# Altium schematic sheet LVR_3V3_PS.SchDoc: 3V3 Linear Voltage Regulator
size B; Date: 2015-01-30; Author: Marcin Czajkowski; Organization: Marcin Czajkowski; Address1: SN:3547684; Address2: ESE-Year2; Address3: Conestoga College; Address4: Project IV; DocumentNumber: 1; Revision: A; SheetNumber: 10; SheetTotal: 14
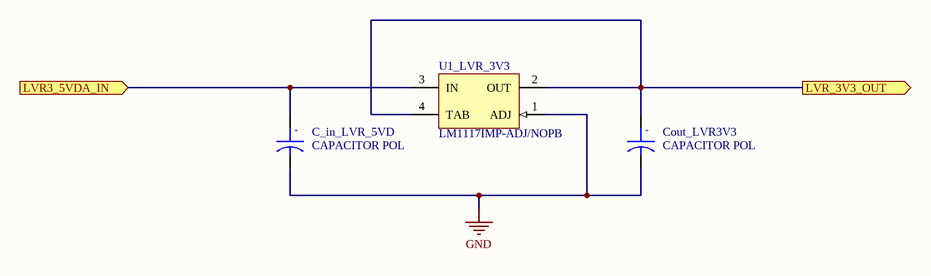
[diagram p0: LVR_3V3_PS.SchDoc]

## Parts
C_in_LVR_5VD  CAPACITOR POL
Cout_LVR3V3  CAPACITOR POL
U1_LVR_3V3  LM1117IMP-ADJ/NOPB  [MP04A_L]

## Ports
LVR3_5VDA_IN (in), LVR_3V3_OUT (out)

## Nets
GND: C_in_LVR_5VD.2 Cout_LVR3V3.2 U1_LVR_3V3.1(ADJ)
LVR3_5VDA_IN: C_in_LVR_5VD.1 U1_LVR_3V3.3(IN) ; port LVR3_5VDA_IN
LVR_3V3_OUT: Cout_LVR3V3.1 U1_LVR_3V3.2(OUT) U1_LVR_3V3.4(TAB) ; port LVR_3V3_OUT

## Notes on the sheet
- ESE
- is the sole property of ESE. Any reproduction
- The Information Contained in this drawing
- Schematic P/N and Name
- Sheet Name
- 299 Doon Valley Drive
- Kitchener, ON N2G 4M4
- Canada
- Approved
- in part or in whole without the written
- permission of ESE is strictly prohibited.
- APPROVALS
- DATE
- Size
- Scale
- B
- NTS
- Bare PCB P/N
- Date
- Sheet
- Rev.
- Checked
- Engineer
- of
- (in symbol CAPACITOR POL) +

## Library data of the parts
U1_LVR_3V3 = LM1117IMP-ADJ/NOPB: 800mA Low-Dropout Linear Regulator, 4-pin SOT-223, Pb-Free; Manufacturer: National Semiconductor; MPN: LM1117MP-3.3/NOPB; PackageTopMarking: XYTT*N03B; PowerWise: N; CompType: LDO IC; PN: LM1117MP-3.3/NOPBCT-ND; Published: 1-Mar-2010; DatasheetVersion: Apr-2006; PackageVersion: revB, Apr-2003; PackageReference: MP04A; Publisher: Altium Limited; PackageDescription: Molded SOT-223, 6.50 x 3.56 x 1.6mm Body, 4 Lead, 2.3mm Pitch; Supplier 1: Digi-Key; Supplier Part Number 1: LM1117IMP-ADJTR-ND; Supplier 2: Digi-Key; Supplier Part Number 2: LM1117IMP-ADJCT-ND; Supplier 3: Digi-Key; Supplier Part Number 3: LM1117IMP-ADJDKR-ND; Supplier 4: Farnell; Supplier Part Number 4: 1469050; PartNumber: LM1117IMP-ADJ/NOPB; RoHS: Y; PinCount: 4; Code_JEDEC: TO-261-AA; Code_IPC: SOT223-4; ComponentLink1Description: LM1117 Datasheet; ComponentLink1URL: http://www.national.com/ds/LM/LM1117.pdf; ComponentLink2Description: LM1117 Web Page; ComponentLink2URL: http://www.national.com/pf/LM/LM1117.html; ComponentLink3Description: MP04A Package Page; ComponentLink3URL: http://www.national.com/packaging/folders/mp04a.html; URL: http://www.digikey.ca/product-detail/en/LM1117MP-3.3%2FNOPB/LM1117MP-3.3%2FNOPBCT-ND